# EAGLE design Adafruit WICED WiFi Feather (EAGLE 6.4)
COMPANY: ADAFRUIT INDUSTRIES; DRAWN: KTOWN; REV: A
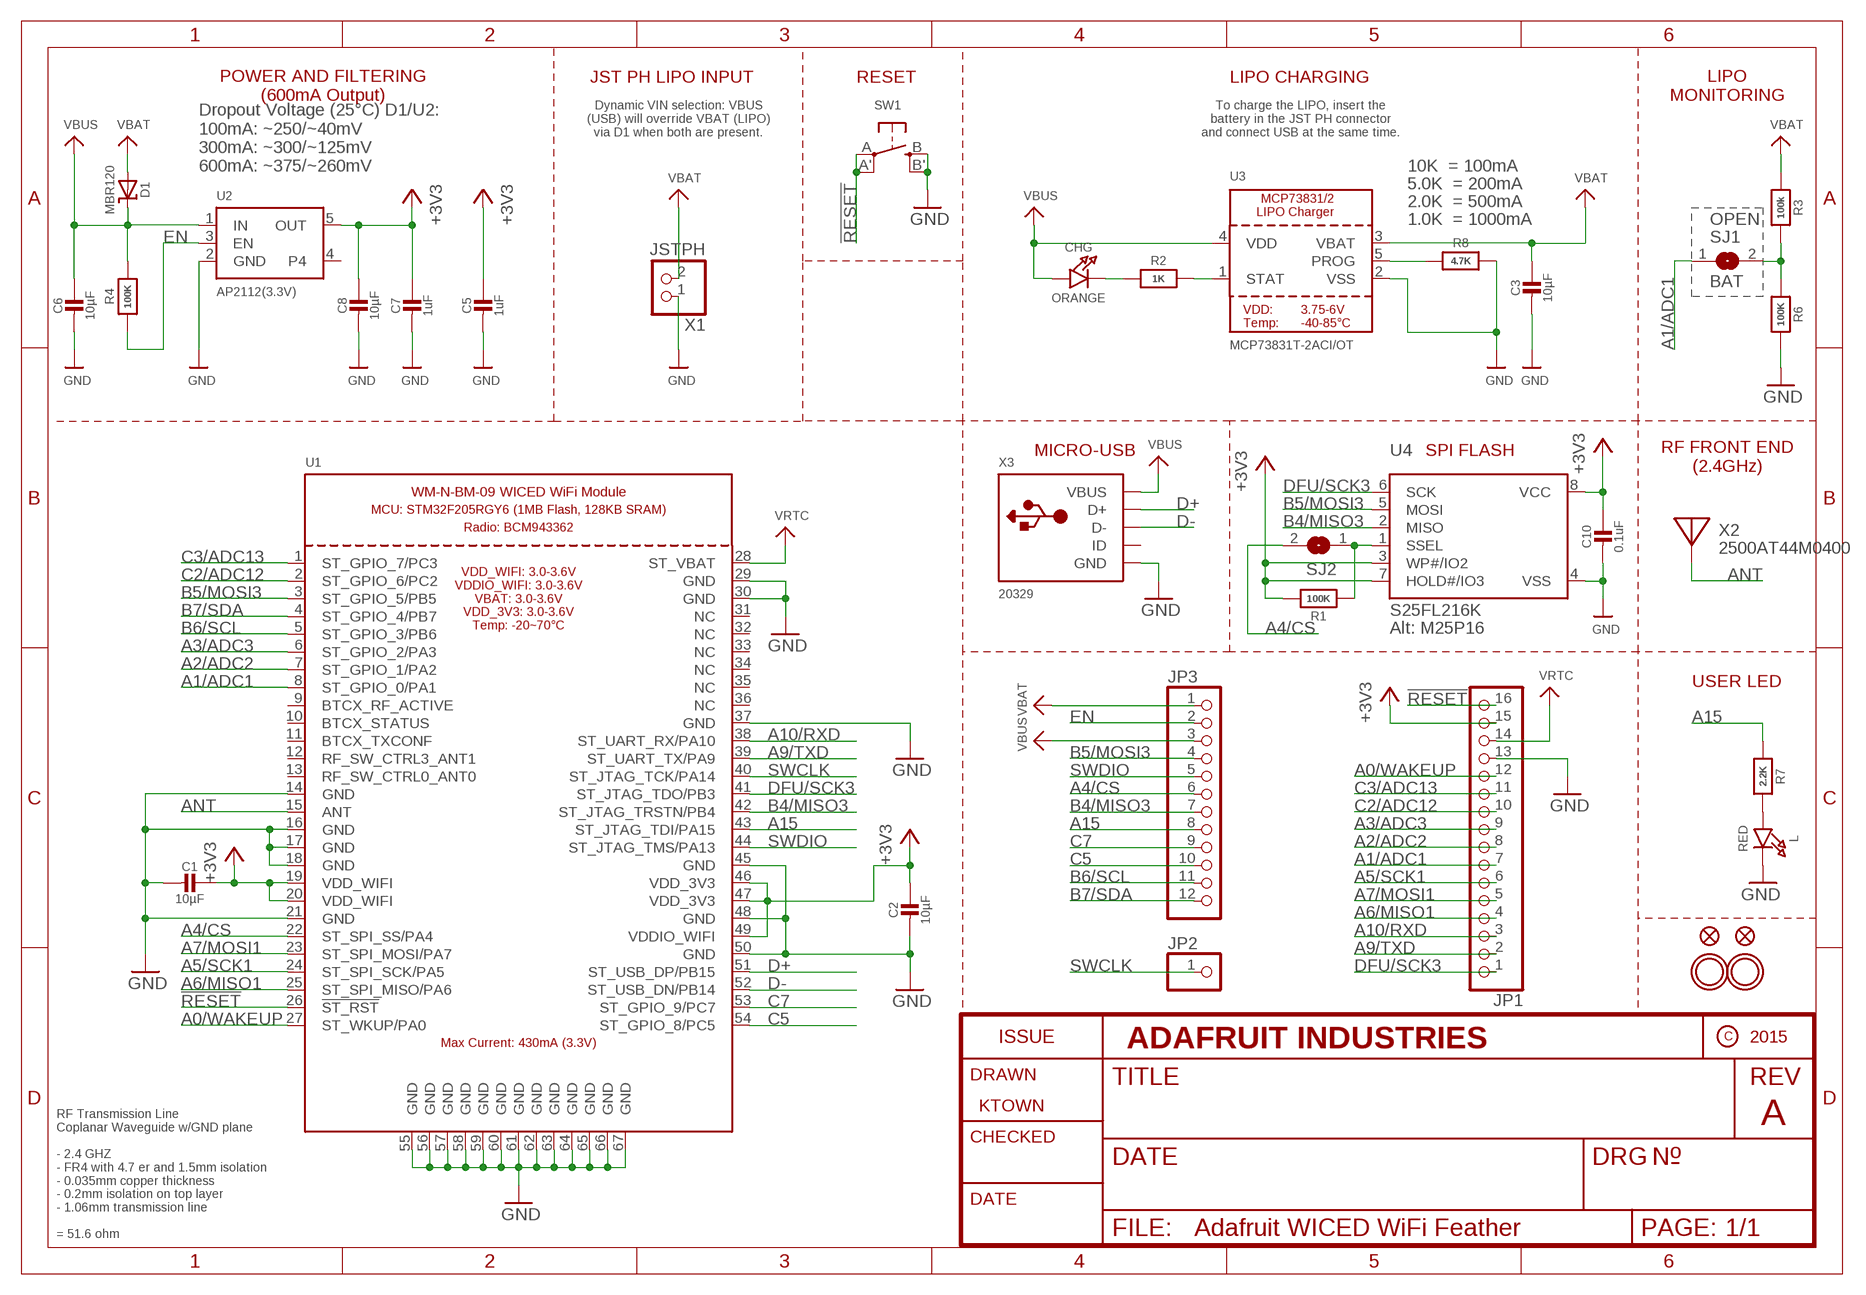
[diagram p0: schematic, sheet 1]

## Parts
C1  10µF  CAP_CERAMIC0805-NOOUTLINE  [0805-NO]
C2  10µF  CAP_CERAMIC0805-NOOUTLINE  [0805-NO]
C3  10µF  CAP_CERAMIC0805-NOOUTLINE  [0805-NO]
C5  1uF  CAP_CERAMIC0603_NO  [0603-NO]
C6  10µF  CAP_CERAMIC0805-NOOUTLINE  [0805-NO]
C7  1uF  CAP_CERAMIC0603_NO  [0603-NO]
C8  10µF  CAP_CERAMIC0805-NOOUTLINE  [0805-NO]
C10  0.1uF  CAP_CERAMIC0805_10MGAP  [0805_10MGAP]
CHG  ORANGE  LED0805_NOOUTLINE  [CHIPLED_0805_NOOUTLINE]
D1  MBR120  DIODE-SCHOTTKYSOD-123  [SOD-123]
JP1  HEADER-1X16ROUND  [1X16_ROUND]
JP2  HEADER-1X1ROUND  [1X01_ROUND]
JP3  HEADER-1X12  [1X12_ROUND]
L  RED  LED0805_NOOUTLINE  [CHIPLED_0805_NOOUTLINE]
R1  100K  RESISTOR_0603_NOOUT  [0603-NO]
R2  1K  RESISTOR_0603_NOOUT  [0603-NO]
R3  100k  RESISTOR_0603_NOOUT  [0603-NO]
R4  100K  RESISTOR_0603_NOOUT  [0603-NO]
R6  100K  RESISTOR_0603_NOOUT  [0603-NO]
R7  2.2K  RESISTOR_0603_NOOUT  [0603-NO]
R8  4.7K  RESISTOR_0603_NOOUT  [0603-NO]
SJ1  BAT  SOLDERJUMPERREFLOW_NOPASTE  [SOLDERJUMPER_REFLOW_NOPASTE]
SJ2  SOLDERJUMPER  [SOLDERJUMPER_ARROW_NOPASTE]
SW1  SWITCH_TACT_SMT4.6X2.8  [BTN_KMR2_4.6X2.8]
U1  USI_WM-N-BM-09  [USI_WM-N-BM-09]
U2  AP2112(3.3V)  VREG_SOT23-5  [SOT23-5]
U3  MCP73831T-2ACI/OT  MCP73831/2  [SOT23-5]
U4  S25FL216K  SPIFLASH_SOIC8  [SOIC8_150MIL]
U$31  MOUNTINGHOLE2.5  [MOUNTINGHOLE_2.5_PLATED]
U$32  MOUNTINGHOLE2.5  [MOUNTINGHOLE_2.5_PLATED]
U$34  FIDUCIAL""  [FIDUCIAL_1MM]
U$35  FIDUCIAL""  [FIDUCIAL_1MM]
X1  JSTPH  CON_JST_PH_2PIN  [JSTPH2]
X2  2500AT44M0400  ANTENNA_JOHANSON_2500AT44M0400  [ANT_2500AT44M0400]
X3  20329  USB_MICRO_20329_V2  [4UCONN_20329_V2]

## Nets
!RESET: JP1.16 SW1.A'(P1) SW1.A(P) U1.26(!ST_RST)
+3V3: C1.1 C2.1 C5.1 C7.1 C8.1 C10.1 JP1.15 R1.2 U1.19(VDD_WIFI) U1.20(VDD_WIFI) U1.46(VDD_3V3) U1.47(VDD_3V3) U1.49(VDDIO_WIFI) U2.5(OUT) U4.3(WP#/IO2) U4.7(HOLD#/IO3) U4.8(VCC)
A0/WAKEUP: JP1.12 U1.27(ST_WKUP/PA0)
A1/ADC1: JP1.7 SJ1.1 U1.8(ST_GPIO_0/PA1)
A2/ADC2: JP1.8 U1.7(ST_GPIO_1/PA2)
A3/ADC3: JP1.9 U1.6(ST_GPIO_2/PA3)
A4/CS: JP3.6 SJ2.2 U1.22(ST_SPI_SS/PA4)
A5/SCK1: JP1.6 U1.24(ST_SPI_SCK/PA5)
A6/MISO1: JP1.4 U1.25(ST_SPI_MISO/PA6)
A7/MOSI1: JP1.5 U1.23(ST_SPI_MOSI/PA7)
A9/TXD: JP1.2 U1.39(ST_UART_TX/PA9)
A10/RXD: JP1.3 U1.38(ST_UART_RX/PA10)
A15: JP3.8 R7.1 U1.43(ST_JTAG_TDI/PA15)
ANT: U1.15(ANT) X2.FEED
B4/MISO3: JP3.7 U1.42(ST_JTAG_TRSTN/PB4) U4.2(MISO)
B5/MOSI3: JP3.4 U1.3(ST_GPIO_5/PB5) U4.5(MOSI)
B6/SCL: JP3.11 U1.5(ST_GPIO_3/PB6)
B7/SDA: JP3.12 U1.4(ST_GPIO_4/PB7)
C2/ADC12: JP1.10 U1.2(ST_GPIO_6/PC2)
C3/ADC13: JP1.11 U1.1(ST_GPIO_7/PC3)
C5: JP3.10 U1.54(ST_GPIO_8/PC5)
C7: JP3.9 U1.53(ST_GPIO_9/PC7)
D+: U1.51(ST_USB_DP/PB15) X3.D+
D-: U1.52(ST_USB_DN/PB14) X3.D-
DFU/SCK3: JP1.1 U1.41(ST_JTAG_TDO/PB3) U4.6(SCK)
EN: JP3.2 R4.1 U2.3(EN)
GND: C1.2 C2.2 C3.2 C5.2 C6.2 C7.2 C8.2 C10.2 JP1.13 L.C R6.2 R8.2 SW1.B'(S1) SW1.B(S) U1.14(GND) U1.16(GND) U1.17(GND) U1.18(GND) U1.21(GND) U1.29(GND) U1.30(GND) U1.37(GND) U1.45(GND) U1.48(GND) U1.50(GND) U1.55(GND) U1.56(GND) U1.57(GND) U1.58(GND) U1.59(GND) U1.60(GND) U1.61(GND) U1.62(GND) U1.63(GND) U1.64(GND) U1.65(GND) U1.66(GND) U1.67(GND) U2.2(GND) U3.2(VSS) U4.4(VSS) X1.1 X3.BASE@1(GND) X3.BASE@2(GND) X3.GND X3.SPRT@1(GND) X3.SPRT@2(GND) X3.SPRT@3(GND) X3.SPRT@4(GND)
N$1: CHG.C R2.1
N$2: L.A R7.2
N$3: R2.2 U3.1(STAT)
N$4: R8.1 U3.5(PROG)
N$5: R3.2 R6.1 SJ1.2
N$6: R1.1 SJ2.1 U4.1(SSEL)
SWCLK: JP2.1 U1.40(ST_JTAG_TCK/PA14)
SWDIO: JP3.5 U1.44(ST_JTAG_TMS/PA13)
VBAT: C3.1 D1.A JP3.1 R3.1 U3.3(VBAT) X1.2
VBUS: C6.1 CHG.A D1.C JP3.3 R4.2 U2.1(IN) U3.4(VDD) X3.VBUS
VRTC: JP1.14 U1.28(ST_VBAT)
Unconnected: U1.9(BTCX_RF_ACTIVE) U1.10(BTCX_STATUS) U1.11(BTCX_TXCONF) U1.12(RF_SW_CTRL3_ANT1) U1.13(RF_SW_CTRL0_ANT0) U1.31(NC) U1.32(NC) U1.33(NC) U1.34(NC) U1.35(NC) U1.36(NC) U2.4 X3.ID

## Notes on the sheet
- JST PH LIPO INPUT | RESET | LIPO CHARGING
- POWER AND FILTERING
  (600mA Output)
- LIPO
  MONITORING
- Dynamic VIN selection: VBUS
  (USB) will override VBAT (LIPO)
  via D1 when both are present.
- To charge the LIPO, insert the
  battery in the JST PH connector
  and connect USB at the same time.
- Dropout Voltage (25°C) D1/U2:
  100mA: ~250/~40mV
  300mA: ~300/~125mV
  600mA: ~375/~260mV
- 10K  = 100mA
- 5.0K  = 200mA
- 2.0K  = 500mA
- 1.0K  = 1000mA | OPEN
- MICRO-USB | SPI FLASH
- RF FRONT END
  (2.4GHz)
- Alt: M25P16
- USER LED
- RF Transmission Line
  Coplanar Waveguide w/GND plane
  
  - 2.4 GHZ
  - FR4 with 4.7 er and 1.5mm isolation
  - 0.035mm copper thickness
  - 0.2mm isolation on top layer
  - 1.06mm transmission line
  
  = 51.6 ohm

## Library data of the parts
C1-C3 C5-C8 C10 = microbuilder:CAP_CERAMIC: Ceramic Capacitors For new designs, use the packages preceded by an '_' character since they are more reliable: The following footprints should be used on most boards: _0402 - Standard footprint for regular board layouts _0603 - Standard footprint for regular board layouts _0805 - Standard footprint for regular board layouts _1206 - Standard footprint for regular board layouts For extremely tight-pitch boards where space is at a premium, the following 'micro-pitch' footprints can be used (smaller pads, no silkscreen outline, etc.): _0402MP - Micro-pitch footprint for very dense/compact boards _0603MP - Micro-pitch footprint for very dense/compact boards _0805MP - Micro-pitch footprint for very dense/compact boards _1206MP - Micro-pitch footprint for very dense/compact boards
CHG L = microbuilder:LED: LED 0603 - 0603 Surface Mount Package 2mA: Green LED - Low Power (3.9mcd, 2ma, 1.7Vf) - Digikey: 475-2709-2-ND Orange LED - Low Power (9.8mcd, 2ma, 1.8Vf) - Digikey: 475-1194-2-ND Red LED - Low Power (5mcd, 2ma, 1.8Vf) - Digikey: 475-1195-2-ND Yellow LED - Low Power (7mcd, 2ma, 1.8Vf) - Digikey: 475-1196-2-ND 5mA: Blue LED - Low Power (17mcd, 5ma, 2.9Vf) - Digikey: LNJ937W8CRACT-ND 0805 - 0805 Surface Mount Package 2mA: Red LED (8.8mcd, 2mA, 1.8Vf, Clear) - Low Power [Digikey: 475-2510-1-ND] Green LED (5mcd, 2mA, 1.8Vf, Clear) - Low Power [Digikey: 475-2730-1-ND] Yellow LED (11.3mcd, 2mA, 1.8Vf, Clear) - Low Power [Digikey: 475-2555-1-ND] 20mA: Red LED (104mcd, 20mA, Diffused) - LS R976 [Digikey: 475-1278-6-ND] Red LED (12mcd, 20mA, 2.0Vf, Clear) - APT2012EC [Digikey: 754-1128-1-ND] Green LED (15mcd, 20mA, 2.2Vf, Clear) - APT2012GC [Digikey: 754-1131-1-ND] Orange LED (160mcd, 20mA, 2.1Vf, Clear) - APT2012SECK [Digikey: 754-1130-1-ND] 1206 - 1206 Surface Mount Package Green LED (26mcd, 20mA, Diffused) - LG N971 [Digikey: 475-1407-6-ND] Red LED (15mcd, 20mA, Diffused) - LH N974 [Digikey: 475-1416-6-ND] Cree - Cree High-Power Surface Mount LEDs XPEBWT-L1-0000-00D50 - White 111lm 350mA 2.9Vf 6200K 110° XTEAWT-00-0000-00000LEE3 - White 114lm 350mA 2.85Vf 5000K 115° Everlight - Everlight 45-21 Series Surface Mount LEDs 45-21/QK2C-B2832AC2CB2/2T - Warm White 2000mcd 20mA 3.25Vf 3050K 120° 45-21/LK2C-B38452C4CB2/2T - Nuetral White 2000mcd 20mA 3.25Vf 4150K 120° 45-21/LK2C-B50634C6CB2/2T - Cold White 2200mcd 20mA 3.25Vf 5650K 120° PLCC2 Reverse Mount LS T77K-J1L2-1-0-2-R18-Z - Red 11.25mcd 2mA 1.8Vf 630nm 120° LO T77K-L1M2-24-Z - Orange 19.6mcd 2mA 1.8Vf 606nm 120° LY T77K-K2M1-26-Z - Yellow 15.7mcd 2mA 1.8Vf 587nm 120°
D1 = microbuilder:DIODE-SCHOTTKY
JP1 = microbuilder:HEADER-1X16: PIN HEADER
JP2 = microbuilder:HEADER-1X1: PIN HEADER
JP3 = microbuilder:HEADER-1X12
R1-R4 R6-R8 = microbuilder:RESISTOR: Resistors For new designs, use the packages preceded by an '_' character since they are more reliable: The following footprints should be used on most boards: _0402 - Standard footprint for regular board layouts _0603 - Standard footprint for regular board layouts _0805 - Standard footprint for regular board layouts _1206 - Standard footprint for regular board layouts For extremely tight-pitch boards where space is at a premium, the following 'micro-pitch' footprints can be used (smaller pads, no silkscreen outline, etc.): _0402MP - Micro-pitch footprint for very dense/compact boards _0603MP - Micro-pitch footprint for very dense/compact boards _0805MP - Micro-pitch footprint for very dense/compact boards _1206MP - Micro-pitch footprint for very dense/compact boards
SJ1 = microbuilder:SOLDERJUMPER: SMD Solder JUMPER Solder the two pads together to create a connection, or remove the solder to break it. REFLOW - Use this footprint for solder paste and reflow ovens. WAVE - Use this footprint for hand-soldering (larger pads). CLOSED - Has a trace between the two pads to ensure it is closed by default. The trace needs to be cut to disable the jumper, and can be closed again by creating a solder bridge between the two pads.
SJ2 = microbuilder:SOLDERJUMPER: SMD Solder JUMPER Solder the two pads together to create a connection, or remove the solder to break it. REFLOW - Use this footprint for solder paste and reflow ovens. WAVE - Use this footprint for hand-soldering (larger pads). CLOSED - Has a trace between the two pads to ensure it is closed by default. The trace needs to be cut to disable the jumper, and can be closed again by creating a solder bridge between the two pads.; BOM: EXCLUDE
SW1 = microbuilder:SWITCH_TACT_SMT: SMT Tact Switches 6x6mm - Digikey: P12940SCT-ND KMR2 (4.6x2.8mm) - Digikey: 401-1426-1-ND EVQ-PQHB55 - Light Touch, 160GF (4.5x4.5mm) - Digikey: P8090SCT-ND KMT0 - KMT021 NGJ LHS (etc.) IP68/Waterproof - Digikey: CKN10289CT-ND
U1 = microbuilder:USI_WM-N-BM-09: USI WM-N-BM-09 WICED WiFi Module
U2 = microbuilder:VREG_SOT23-5: SOT23-5 Fixed Voltage Regulators Part Current Out V Out V In V Dropout θJA (°C/W) TJ (°C) Digikey Part No. ADP121 150mA 3.3V 3.4-5.5V 0.09V @ 150mA -- -- ADP121-AUJZ33R7CT-ND ADP121 150mA 3.0V 3.1-5.5V 0.09V @ 150mA -- -- ADP121-AUJZ30R7CT-ND ADP122 300mA 3.3V 3.4-5.5V 0.085V @ 300mA -- -- ADP122AUJZ-3.3-R7CT-ND ADP1712 300mA 3.3V 3.5-5.5V 0.17V @ 300mA -- -- ADP1712AUJZ-3.3-R7TR-ND AP7311 (Low Cost) 150mA 3.3V 3.5-6V 0.15V @ 150mA -- -- AP7311-33WG-7DICT-ND LD39015M18R 150mA 1.8V 1.9V-5.5V 0.08V @ 100mA -- -- 497-6977-1-ND LP2985A-33DBVR 150mA 3.3V 3.3-16V 0.28V @ 150mA 206 150 296-18479-1-ND MCP1824T-3302E/OT 300mA 3.3V 3.5V-6V 0.2V @ 300mA -- -- MCP1824T-3302E/OTCT-ND MIC5205-2.5YM5 TR 150mA 2.5V 2.7-16V 0.165V @ 150mA -- -- 576-1257-2-ND MIC5205-3.0YM5 TR 150mA 3.0V 3.2V-16V 0.165V @ 150mA -- -- 576-1258-2-ND MIC5205-3.3YM5 TR 150mA 3.3V 3.5V-16V 0.165V @ 150mA -- -- 576-1259-2-ND TPS780330220 150mA 3.3V+2.2V 3.6-5.5V 250mV Max -- -- 296-23332-1-ND TDA3663/N1,135 100mA 3.3V 3.5-45V 0.18V @ 50mA -- -- 568-5343-1-ND Max operating temp can be calculated using θJA, TJ (max junction temperature), and power in watts. Set the "Maximum Ambient Temperature" until it reaches TJ ("Max Junction Temperature"), which is the absolute limit for safe use of the regulator: Heat Sink Temperature Calculator <http://www.daycounter.com/Calculators/Heat-Sink-Temperature-Calculator.phtml> For example, With 12V source into a 3.3V LP2985 and a 30mA load, we are dissipating (12V-3.3V) * 0.03A = 0.261W. With a θJA of 206 °C/W, a TJ of 150°C, and 261mW we can safely use the chip without a heat sink up to 75°C (=147.1°C Junction Temperature).
U3 = microbuilder:MCP73831/2: MCP73831/2 LIPO Charger VDD: 3.75 - 6V Temp -40 - 85°C Programmable Charge Rate: 15-500mA NOTE: STAT is a tri-state logic output on the MCP73831 and an open-drain output on the MCP73832. SOT23-5 with 4.2V output and tri-state logic on STAT = MCP73831T-2ACI/OT
U4 = microbuilder:SPIFLASH_SOIC8: SOIC8 SPI Flash Be careful with the size since SOIC8 flash comes in several 'widths' SOIC8 150 mil M25P16 - 16Mbit (2Mbit x 8) Serial Flash (75MHz SPI Bus), Supply: 2.7-3.6V Digikey: SOIC8 - M25P16-VMN6P-ND SOIC8 208 mil W25Q16BVSSIG - 16Mbit (2Mbit x 8) Serial Flash (104MHz SPI Bus), Supply: 2.7-3.6V Digikey: SOIC8 - W25Q16BVSSIG-ND
U$31 U$32 = microbuilder:MOUNTINGHOLE: Mounting Hole For #2 screws (0.086"/2.18mm width, 0.094"/2.4mm hole) use 2.5mm; BOM: EXCLUDE
U$34 U$35 = microbuilder:FIDUCIAL: Fiducial Alignment Points Various fiducial points for machine vision alignment.; BOM: EXCLUDE
X1 = microbuilder:CON_JST_PH_2PIN: JST 2-Pin Right-Angle Connector PH-Series - 4UConnector: 17311 SH-Series - 4UConnector: 07278
X2 = microbuilder:ANTENNA_JOHANSON_2500AT44M0400: Johanson 2.3-2.7 GHz Chip Antenna Frequency Range: 2400 - 2500 Mhz Peak Gain 2.5 dBi typ. (XZ-V) Average Gain 0.5 dBi typ. (XZ-V) Input Power 3W max. Operating Temperature -40 to +85°C Digikey: 712-1403-1-ND Mouser: 609-2500AT44M0400E
X3 = microbuilder:USB: USB Connectors USBMINIB - Surface Mount Female Mini-B USB Connector 4UConnector: 06564

## Board
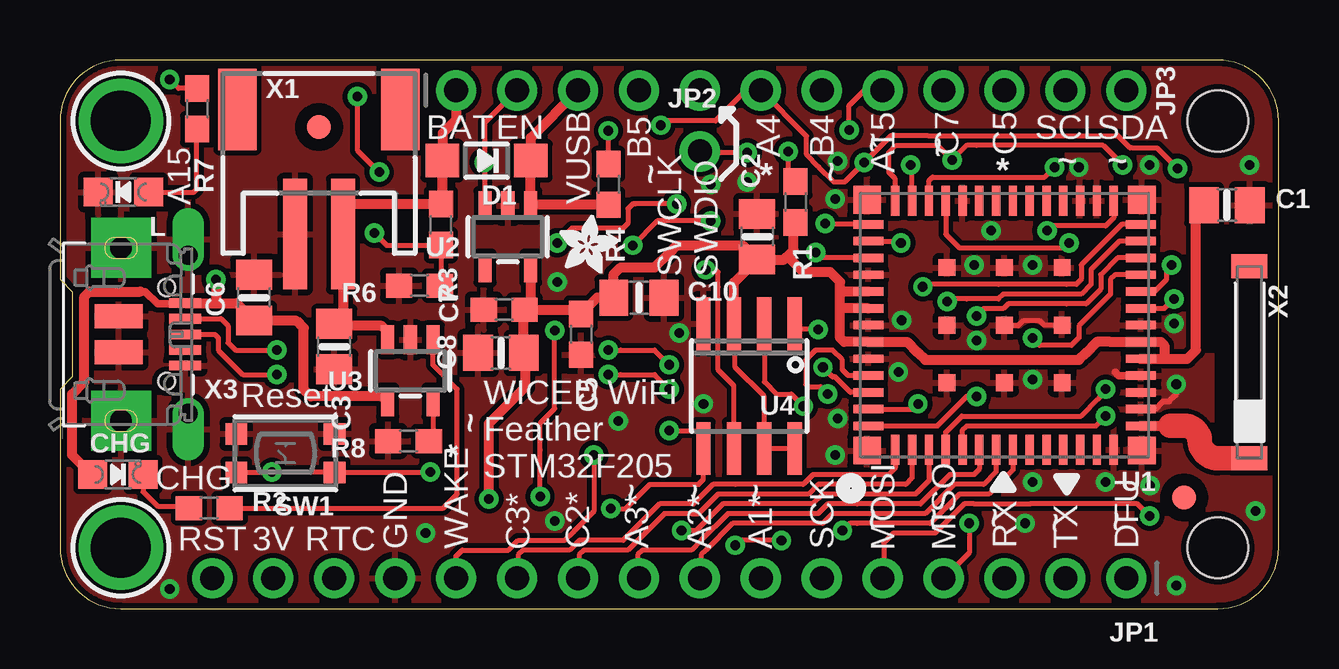
[diagram p1: board, top side]
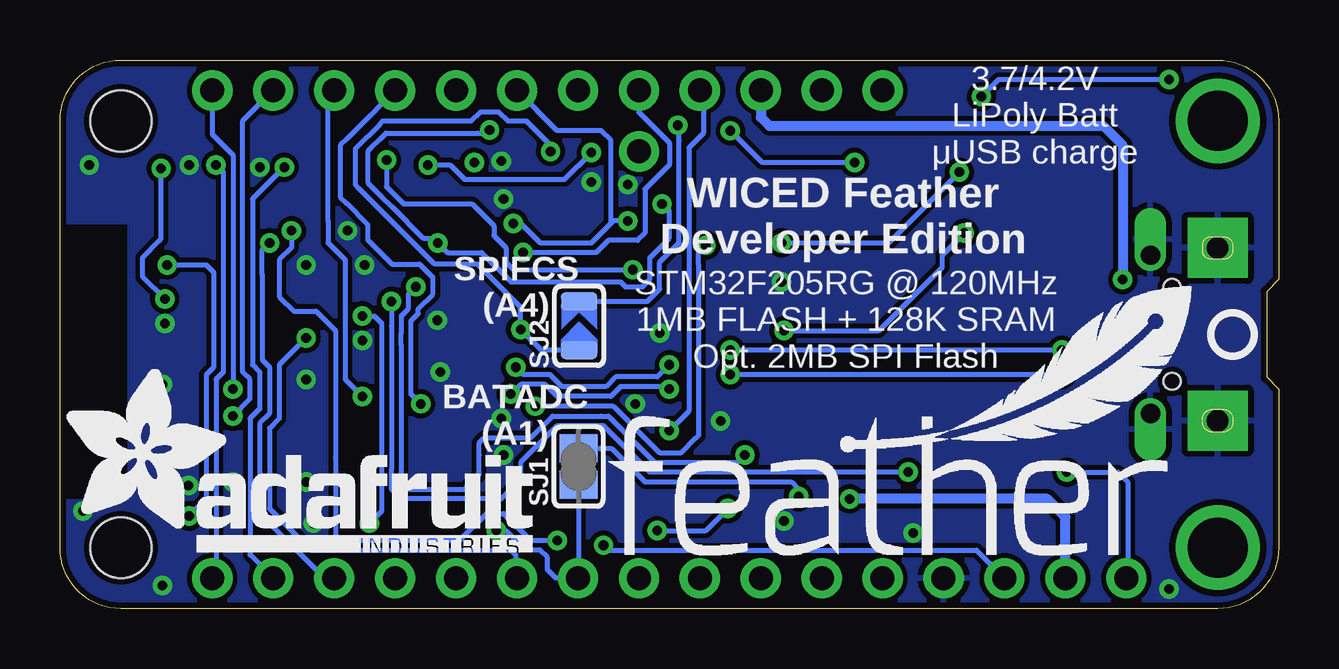
[diagram p2: board, bottom side, seen from below]

Size 50.8 x 22.86 mm. Coordinates in mm from the lower left corner, seen from the top.
Outline: 2.54,0 48.26,0 arc90 50.8,2.54 50.8,20.32 arc90 48.26,22.86 2.54,22.86 arc90 0,20.32 0,13.72 0.51,13.21 0.51,9.65 0,9.14 0,2.54 arc90 2.54,0
Copper layers (1*16): Top 0.035mm / dielectric 1.5mm / Bottom 0.035mm
Design rules "adafruit *": minimum track width 8mil, minimum drill 15.5mil, track to track 8mil, track to pad 8mil, pad to pad 8mil, via to via 8mil, smd to smd 8mil, copper to edge 10mil, drill to drill 8mil, minimum pad ring 10mil, minimum via ring 8mil, stop-mask expansion 2mil, vias tented up to drill 20mil, thermal gap 10mil
Holes 2.54 mm at 48.26,20.32 48.26,2.54
tRestrict: area 44.2,6.4 to 44.3,6.8; area 44.8,8.6 to 45.3,8.7; area 44.8,9.3 to 45.3,9.4; area 42.8,16.8 to 42.9,17.3; area 48.1,7 to 50.5,13.6; area 48.1,13.6 to 48.6,16; area 48.6,14.9 to 50.5,16; area 47.8,10.7 to 48.1,16
bRestrict: area 48,4.6 to 50.5,16

### Footprints (pad centres in the part's own frame; a part is rotated, then mirrored left to right if it is on the bottom)
0805-NO = smd 1.24 x 1.5: 1 -0.95,0; 2 0.95,0
0603-NO = smd 1.1 x 1: 1 -0.85,0; 2 0.85,0
0805_10MGAP = smd 1.2 x 1.5: 1 -1.05,0; 2 1.05,0
CHIPLED_0805_NOOUTLINE = smd 1.2 x 1.2: A 0,-1.05; C 0,1.05
SOD-123 = smd 1.4 x 1.4: A 1.85,0; C -1.85,0
1X16_ROUND = drill 1 pad 1.676: 1 -19.05,0; 2 -16.51,0; 3 -13.97,0; 4 -11.43,0; 5 -8.89,0; 6 -6.35,0; 7 -3.81,0; 8 -1.27,0; 9 1.27,0; 10 3.81,0; 11 6.35,0; 12 8.89,0; 13 11.43,0; 14 13.97,0; 15 16.51,0; 16 19.05,0
1X01_ROUND = drill 1 pad 1.676: 1 0,0
1X12_ROUND = drill 1 pad 1.676: 1 -13.97,0; 2 -11.43,0; 3 -8.89,0; 4 -6.35,0; 5 -3.81,0; 6 -1.27,0; 7 1.27,0; 8 3.81,0; 9 6.35,0; 10 8.89,0; 11 11.43,0; 12 13.97,0
SOLDERJUMPER_REFLOW_NOPASTE = smd 1.168 x 1.6: 1 -0.762,0; 2 0.762,0
SOLDERJUMPER_ARROW_NOPASTE = smd 0.762 x 1.524: 1 -1.016,0; 2 1.016,0
BTN_KMR2_4.6X2.8 = smd 0.9 x 0.9: A 2.05,0.8; A' -2.05,0.8; B 2.05,-0.8; B' -2.05,-0.8
USI_WM-N-BM-09 = smd 0.35 x 1.25: 1 4.55,5.188; 2 3.85,5.188; 3 3.15,5.188; 4 2.45,5.188; 5 1.75,5.188; 6 1.05,5.188; 7 0.35,5.188; 8 -0.35,5.188; 9 -1.05,5.188; 10 -1.75,5.188; 11 -2.45,5.188; 12 -3.15,5.188; 13 -3.85,5.188; 14 -4.55,5.188; 28 -4.55,-5.188; 29 -3.85,-5.188; 30 -3.15,-5.188; 31 -2.45,-5.188; 32 -1.75,-5.188; 33 -1.05,-5.188; 34 -0.35,-5.188; 35 0.35,-5.188; 36 1.05,-5.188; 37 1.75,-5.188; 38 2.45,-5.188; 39 3.15,-5.188; 40 3.85,-5.188; 41 4.55,-5.188 | smd 1.25 x 0.35: 15 -5.675,4.2; 16 -5.675,3.5; 17 -5.675,2.8; 18 -5.675,2.1; 19 -5.675,1.4; 20 -5.675,0.7; 21 -5.675,0; 22 -5.675,-0.7; 23 -5.675,-1.4; 24 -5.675,-2.1; 25 -5.675,-2.8; 26 -5.675,-3.5; 27 -5.675,-4.2; 42 5.675,-4.2; 43 5.675,-3.5; 44 5.675,-2.8; 45 5.675,-2.1; 46 5.675,-1.4; 47 5.675,-0.7; 48 5.675,0; 49 5.675,0.7; 50 5.675,1.4; 51 5.675,2.1; 52 5.675,2.8; 53 5.675,3.5; 54 5.675,4.2 | smd 1.15 x 1.15: 55 5.725,5.225; 56 -5.725,5.225; 57 -5.725,-5.225; 58 5.725,-5.225 | smd 0.7 x 0.7: 59 2.4,2.4; 60 0,2.4; 61 -2.4,2.4; 62 2.4,0; 63 0,0; 64 -2.4,0; 65 2.4,-2.4; 66 0,-2.4; 67 -2.4,-2.4
SOT23-5 = smd 0.55 x 1.2: 1 -0.95,-1.3; 2 0,-1.3; 3 0.95,-1.3; 4 0.95,1.3; 5 -0.95,1.3
SOIC8_150MIL = smd 0.6 x 2.2: 1 -1.905,-2.6; 2 -0.635,-2.6; 3 0.635,-2.6; 4 1.905,-2.6; 5 1.905,2.6; 6 0.635,2.6; 7 -0.635,2.6; 8 -1.905,2.6
MOUNTINGHOLE_2.5_PLATED = drill 2.5 pad 3.2: P$1 0,0
FIDUCIAL_1MM = smd 1 x 1: 1 0,0
JSTPH2 = smd 1 x 4.6: 1 -1,-3.7; 2 1,-3.7 | smd 1.6 x 3.4: NC1 -3.4,1.5; NC2 3.4,1.5
ANT_2500AT44M0400 = smd 1 x 1.5: FEED 4,0; NC -4,0
4UCONN_20329_V2 = smd 1 x 2: BASE@1 -0.75,-2; BASE@2 0.75,-2 | smd 0.4 x 1.35: D+ 0,0.775; D- -0.65,0.775; GND 1.3,0.775; ID 0.65,0.775; VBUS -1.3,0.775 | drill 0.8 pad 1.2 offset: SPRT@1 -3.3,0.9; SPRT@2 3.3,0.9 | drill 0.9 pad 2.5 square: SPRT@3 -3.6,-1.9; SPRT@4 3.6,-1.9 | hole 0.7: -1.95,0; 1.95,0

### Placement (x,y rotation side)
C1  48.64,16.81 0 top
C2  29.06,15.49 90 top
C3  11.43,10.92 270 top
C5  21.72,11.43 270 top
C6  8.09,12.96 90 top
C7  18.52,12.46 180 top
C8  18.38,10.65 180 top
C10  24.13,12.95 0 top
CHG  2.41,5.59 270 top
D1  17.78,18.67 180 top
JP1  25.4,1.27 180 top
JP2  26.67,19.05 0 top
JP3  30.48,21.59 0 top
L  2.65,17.36 90 top
R1  30.66,16.94 270 top
R2  6.22,4.19 0 top
R3  15.88,16 270 top
R4  22.86,17.68 270 top
R6  14.99,13.46 180 top
R7  5.71,20.83 270 top
R8  14.53,6.99 180 top
SJ1  29.18,5.92 90 bottom
SJ2  29.16,11.79 90 bottom
SW1  9.4,6.48 180 top
U1  39.37,11.81 180 top
U2  18.67,15.49 180 top
U3  14.61,9.91 180 top
U4  28.73,9.27 180 top
U$7  [FEATHERLOGO]  27.94,2.16 0 bottom
U$8  [ADAFRUIT_2.5MM]  20.83,13.97 0 top
U$10  [ADAFRUIT_TEXT_20MM]  50.67,2.36 0 bottom
U$23  [PCBFEAT-REV-040]  1.93,11.43 90 bottom
U$31  2.54,20.32 270 top
U$32  2.54,2.54 270 top
U$34  10.79,20.07 270 top
U$35  46.86,4.63 270 top
X1  10.79,19.3 0 top
X2  49.58,10.26 270 top
X3  4.45,11.43 270 top

### Tracks (layer width: path | path; a pad name or v marks a point on that pad's centre or on a via)
!RESET  (via drill 0.4)
  Top 0.203: SW1.A 8.83,5.68 v8.84,5.69 8.85,5.68 SW1.A' 15.43,5.68 v15.44,5.69 | U1.26 44.16,15.31 42.98,14.12 42.98,13.51 42.57,13.11 41.96,13.11 39.32,13.11 39.12,12.9 37.8,12.9 37.08,12.9 v36.98,12.8
  Bottom 0.203: v8.84,5.69 6.71,5.69 6.3,5.28 6.3,1.32 JP1.16 | v36.98,12.8 36.98,11.79 36.98,5.79 36.98,4.98 36.58,4.57 32.41,4.57 31.6,5.28 31.6,6.1 30.07,7.62 28.14,7.62 26.21,5.69 23.27,5.69 v15.44,5.69
+3V3  (via drill 0.4)
  Top 0.203: U4.3 28.14,11.82 28.14,10.06 29.36,8.84 U4.7 U4.8 | 30.58,16.02 R1.2
  Top 0.305: 32.72,13.21
  Top 0.406: v17.88,4.57 17.88,7.72 19.41,9.25 19.41,10.63 C8.1 19.33,12.43 C7.1 | 19.43,12.43 C7.1 | U2.5 19.62,12.61 C7.1 | C7.1 21.53,12.46 C5.1 22.39,12.95 C10.1 23.08,13.94 23.37,14.22 24.79,14.22 25.4,14.83 25.7,15.14 28.46,15.14 C2.1 | 28.94,14.43 C2.1 | U4.3 28.09,13.58 C2.1 | C2.1 30.19,14.54 30.33,14.68 | 30.33,14.68 30.58,14.94 30.58,16.02 | 32.51,13.21 32.72,13.21 U1.46 | U1.19 46.02,10.41 | 46.02,10.41 46.99,10.41 47.35,10.77 47.35,16.47 C1.1 | 46.02,10.41 46.02,10.97 45.89,11.11 U1.20 43.79,11.11 43.22,11.11 43.18,11.07 42.77,10.67 42.47,10.36 36.07,10.36 35.76,10.67 35.32,11.11 U1.49 32.68,11.11 32.51,11.28 32.51,12.5 | 32.51,12.5 32.51,13.21 | U1.47 32.53,12.51 32.51,12.5 | 32.51,13.21 32.51,13.61 32.11,14.02 30.99,14.02 30.33,14.68 | 28.77,14.83 C2.1
  Bottom 0.406: JP1.15 8.89,3.81 9.65,4.57 v17.88,4.57
A0/WAKEUP  (via drill 0.4)
  Top 0.203: U1.27 44.26,16.01 43.79,15.54 42.57,14.33 42.57,13.72 42.37,13.51 41.96,13.51 39.12,13.51 36.25,13.51 36.07,13.51 v35.97,13.41 | JP1.12 16.51,2.18 16.76,2.44 18.69,2.44 19.1,2.85 21.03,2.85 21.44,3.25 22.25,4.06 v22.25,6.4
  Bottom 0.203: v22.25,6.4 22.55,6.1 23.06,6.1 26.01,6.1 27.94,8.03 28.25,8.03 30.28,8.03 31.19,7.11 33.12,7.11 33.33,6.91 33.33,6.4 33.33,5.59 33.93,4.98 36.37,4.98 36.58,5.18 36.58,5.79 36.58,10.97 36.58,11.48 36.58,12.19 36.27,12.5 36.27,13.11 v35.97,13.41
A1/ADC1  (via drill 0.4)
  Top 0.203: U1.8 39.72,5.79 38.71,4.78 37.49,4.78 36.27,3.56 33.22,3.56 32.92,3.56 v32.61,3.25
  Bottom 0.203: v32.61,3.25 32.21,3.25 31.39,2.44 30.79,2.44 30.48,2.13 30.48,1.63 30.12,1.27 JP1.7 29.18,1.29 SJ1.1
A2/ADC2
  Top 0.203: U1.7 39.02,5.7 38.51,5.18 37.29,5.18 36.07,3.96 33.22,3.96 32.31,3.96 32.21,3.96 31.8,3.56 28.04,3.56 26.92,2.44 26.72,2.23 26.72,1.32 JP1.8
A3/ADC3
  Top 0.203: U1.6 38.32,5.81 38.1,5.59 37.08,5.59 35.87,4.37 33.22,4.37 32.11,4.37 32,4.37 31.6,3.96 27.84,3.96 26.72,2.85 26.31,2.44 24.28,2.44 24.08,2.23 24.08,1.32 JP1.9
A4/CS  (via drill 0.4)
  Top 0.203: U1.22 46.04,12.51 v46.43,12.9 | v46.58,18.34 45.72,19.2 44.7,19.2 44.6,19.2 44.2,19.61 44.09,19.71 36.17,19.71 34.65,19.71 34.14,19.2 v33.53,18.59 32.72,17.78 32.26,17.78 31.62,18.41 31.11,18.92 31.11,19.68 JP3.6 28.6,21.59 27.33,20.32 25.22,20.32 v25.04,20.14
  Bottom 0.203: v46.43,12.9 47.35,13.82 47.35,14.63 46.63,15.34 46.58,15.39 v46.58,18.34 | SJ2.2 26.31,12.8 25.81,13.31 25.81,14.43 24.99,15.24 24.99,19.51 24.99,19.94 24.99,20.09 v25.04,20.14
A5/SCK1  (via drill 0.4)
  Top 0.203: U1.24 43.98,13.91 43.79,13.72 43.79,13.11 42.47,11.79 42.47,11.28 42.16,10.97 40.84,10.97 v40.54,11.28
  Bottom 0.203: JP1.6 31.8,1.32 31.8,2.23 32,2.44 40.34,2.44 41.66,3.76 42.06,4.17 42.06,7.52 41.66,7.92 41.66,10.16 v40.54,11.28
A6/MISO1  (via drill 0.4)
  Top 0.203: U1.25 44.08,14.61 43.38,13.92 43.38,13.31 42.77,12.7 41.96,12.7 39.52,12.7 39.32,12.5 38.51,12.5 v38.2,12.19 | v37.9,3.56 37.9,2.34 JP1.4
  Bottom 0.203: v38.2,12.19 37.69,12.19 37.39,11.89 37.39,4.06 v37.9,3.56
A7/MOSI1  (via drill 0.4)
  Top 0.203: U1.23 45.62,13.21 45.92,13.51 46.13,13.72 46.13,14.12 v46.33,14.33 | v45.41,3.86 44.91,4.37 40.44,4.37 38.1,4.37 37.69,4.37 36.47,3.15 34.75,3.15 34.34,2.74 34.34,1.32 JP1.5
  Bottom 0.203: v46.33,14.33 44.7,14.33 44.4,14.02 44.4,10.06 44.7,9.75 44.7,5.59 44.7,4.57 v45.41,3.86
A9/TXD  (via drill 0.4)
  Top 0.203: U1.39 36.22,17.83 36.37,17.98 41.05,17.98 v41.45,18.39
  Bottom 0.203: v41.45,18.39 41.91,17.93 42.77,17.07 42.77,10.16 42.47,9.86 42.47,8.33 42.88,7.92 42.88,2.23 JP1.2
A10/RXD  (via drill 0.4)
  Top 0.203: U1.38 36.92,15.61 36.98,15.54 37.19,15.34 37.49,15.04 41.86,15.04 v42.06,15.24
  Bottom 0.203: JP1.3 39.78,1.27 41.45,2.95 42.47,3.96 42.47,7.72 42.06,8.13 42.06,10.06 42.37,10.36 42.37,13.92 42.37,14.94 v42.06,15.24
A15  (via drill 0.4)
  Top 0.203: R7.1 4.94,21.68 v4.57,22.05 | v12.39,21.34 12.39,19.1 v13.31,18.19 | U1.43 34.98,15.31 v35.05,15.24 | v25.7,16.87 23.98,16.87 23.88,16.87 23.67,16.66 23.67,16.05 23.47,15.85 22.66,15.85 21.34,15.85 v20.73,15.24 | v32.89,19.94 32.89,20.95 33.53,21.59 JP3.8
  Bottom 0.203: v4.57,22.05 11.68,22.05 v12.39,21.34 | v25.7,16.87 25.4,16.56 25.4,15.44 26.21,14.63 26.21,13.72 26.52,13.41 27.23,13.41 27.43,13.61 32,13.61 33.22,14.83 34.65,14.83 v35.05,15.24 35.26,15.44 35.66,15.44 36.98,16.76 37.39,17.17 37.97,17.75 37.97,19.05 37.85,19.18 37.47,19.56 37.21,19.81 33.4,19.81 33.02,19.81 v32.89,19.94 | v20.73,15.24 16.26,15.24 v13.31,18.19
ANT
  Top 0.406: U1.15 46.29,7.61
  Top 1.016: X2.FEED 48.24,6.26 arc-90 47.5,7.1 arc90 46.69,7.61 46.29,7.61
B4/MISO3  (via drill 0.4)
  Top 0.203: U1.42 31.94,16.01 v31.9,16.05 | v27.13,16.15 24.89,16.15 v23.88,15.14 | U4.2 29.36,9.45 29.87,8.94 30.48,8.94 v30.99,8.43
  Bottom 0.203: v31.9,16.05 31.6,16.05 30.79,15.24 28.65,15.24 27.84,16.05 | 27.84,16.05 27.84,19.51 28.25,19.91 30.07,19.91 JP3.7 | v27.13,16.15 27.74,16.15 27.84,16.05 | v23.88,15.14 24.18,14.83 24.18,14.33 24.18,7.21 24.28,7.11 24.89,6.5 25.81,6.5 27.74,8.43 v30.99,8.43
B5/MOSI3  (via drill 0.4)
  Top 0.203: U1.3 36.22,5.33 35.66,4.78 33.22,4.78 31.9,4.78 31.8,4.78 31.39,4.37 27.64,4.37 26.52,3.25 v25.91,3.25 | 26.89,6.71 U4.5 | v22.96,4.17 23.57,4.17 24.59,5.18 26.62,5.18 26.82,5.38 U4.5 | v25.4,7.42 26.62,7.42 26.82,7.21 U4.5
  Bottom 0.203: v25.91,3.25 23.88,3.25 v22.96,4.17 | JP3.4 23.98,21.44 23.98,19.81 24.59,19.2 24.59,8.23 v25.4,7.42
B6/SCL  (via drill 0.4)
  Top 0.203: U1.5 37.62,7.45 37.8,7.62 43.18,7.62 v43.59,8.03
  Bottom 0.203: v43.59,8.03 42.88,8.74 42.88,9.55 43.18,9.86 43.18,20.32 JP3.11
B7/SDA  (via drill 0.4)
  Top 0.203: v43.59,9.14 43.59,9.04 43.28,8.74 42.57,8.03 37.59,8.03 36.92,7.35 U1.4
  Bottom 0.203: JP3.12 44.45,19.76 43.59,18.9 v43.59,9.14
C2/ADC12
  Top 0.203: U1.2 35.52,5.95 35.52,5.45 35.26,5.18 34.75,5.18 33.22,5.18 31.7,5.18 31.6,5.18 31.19,4.78 27.43,4.78 27.03,4.37 26.62,3.96 26.31,3.96 25.2,3.96 23.67,2.44 21.84,2.44 21.64,2.23 21.64,1.32 JP1.10
C3/ADC13
  Top 0.203: U1.1 34.82,5.86 34.65,5.69 34.54,5.59 33.22,5.59 31.5,5.59 31.39,5.59 31.09,5.28 30.99,5.18 28.14,5.18 27.23,5.18 26.42,4.37 24.99,4.37 23.47,2.85 21.64,2.85 21.23,2.44 19.3,2.44 19.1,2.23 19.1,1.32 JP1.11
C5  (via drill 0.4)
  Top 0.203: v38.2,8.84 37.8,8.84 36.58,7.62 36.57,7.61 U1.54
  Bottom 0.203: v38.2,8.84 38.91,9.55 38.91,14.53 39.62,15.24 39.62,16.15 39.62,21.34 JP3.10
C7  (via drill 0.4)
  Top 0.203: U1.53 35.54,8.31 v35.76,8.53
  Bottom 0.203: JP3.9 36.88,21.54 37.39,21.03 37.9,20.52 38.61,19.81 38.86,19.56 39.12,19.3 39.12,17.14 38.86,16.89 37.97,16 37.97,15.37 36.96,14.35 35.81,14.35 35.31,13.84 35.26,13.79 35.26,13.11 35.87,12.5 35.87,12.29 36.17,11.99 36.17,8.94 v35.76,8.53
D+  (via drill 0.4)
  Top 0.203: X3.D+ 6.45,11.43 6.6,11.28 6.6,10.77 7.62,9.75 v9.04,9.75 | v22.86,9.75 23.37,9.75 24.79,9.75 v25.4,9.14 | U1.51 32.86,9.71 32.61,9.96 32.61,10.36 32.21,10.77 31.5,10.77 31.09,10.36 31.09,9.35 31.19,9.25 31.7,9.25 v32,8.94
  Bottom 0.203: v9.04,9.75 v22.86,9.75 | v25.4,9.14 25.5,9.25 27.43,9.25 27.84,8.84 30.07,8.84 30.58,9.35 31.6,9.35 v32,8.94
D-  (via drill 0.4)
  Top 0.203: X3.D- 6.72,12.08 7.01,11.79 7.01,11.07 7.32,10.77 v9.04,10.77 | v22.86,10.77 23.37,10.77 24.79,10.77 v25.4,10.16 | U1.52 32.95,9.01 32.41,9.55 32.31,9.65 32.21,9.65 v31.8,10.06
  Bottom 0.203: v9.04,10.77 v22.86,10.77 | v25.4,10.16 25.91,9.65 27.64,9.65 28.04,9.25 29.87,9.25 30.38,9.75 31.5,9.75 v31.8,10.06
DFU/SCK3  (via drill 0.4)
  Top 0.203: U1.41 34.82,17.91 34.54,18.19 34.54,19 34.85,19.3 35.97,19.3 36.58,19.3 v37.19,18.69 37.8,19.3 38.2,19.3 43.48,19.3 43.59,19.2 v44.3,18.49 | U4.6 28.09,9.3 27.53,9.86 27.43,9.96 27.43,13.41 27.43,14.02 27.33,14.12 v26.92,14.12
  Bottom 0.203: v44.3,18.49 43.99,18.19 43.99,9.86 44.3,9.55 44.3,1.42 JP1.1 | v26.92,14.12 31.9,14.12 32.21,14.43 32.21,15.04 32.72,15.54 32.72,15.95 33.63,16.87 34.44,16.87 36.47,16.87 37.19,17.58 v37.19,18.69
EN  (via drill 0.4)
  Top 0.203: U2.3 17.72,18.59 | 17.72,18.59 17.72,20.26 JP3.2 | R4.1 v22.86,19.91 | v17.68,18.59 17.72,18.59
  Bottom 0.203: v22.86,19.91 21.95,19 21.54,18.59 v17.68,18.59
GND  (via drill 0.4)
  Top 0.203: U1.64 41.02,11.81 40.84,11.99 40.13,11.99 39.93,11.79 39.4,11.79 U1.63
  Top 0.254: U1.16 45.65,8.31 45.97,8.64 46.23,8.64 46.48,8.89 46.53,8.94 v46.53,9.35
  Top 0.305: U1.18 44.34,9.71 44.14,9.71 43.99,9.86
  other vias: 38.81,15.75 38.1,14.33 38.2,11.18 40.54,9.55 40.54,14.33 45.44,5.13 43.59,5.28 46.43,11.89 45.42,18.49 49.58,18.49 42.47,18.39 40.54,5.28 28.65,17.78 34.95,9.86 32.31,6.4 25.81,11.48 32.31,17.07 27.13,17.68 32.41,18.64 15.24,3.15 20.62,3.66 4.57,0.81 23.27,7.82 26.82,8.53 20.73,13.61 40.23,3.56 32.41,7.92 35.08,12.01 49.83,4.06 46.53,0.97
  pour Top: -0.38,23.24 -0.38,-0.25 50.93,0 50.93,22.86
  pour Bottom: 51.05,0 -0.64,0.38 -0.64,23.24 50.93,22.86
N$1
  Top 0.203: CHG.C 3.46,4.87 4.06,4.27 5.3,4.27 R2.1
N$2
  Top 0.203: L.A 5.57,17.36 5.69,17.48 5.69,19.95 R7.2
N$3
  Top 0.203: R2.2 15.98,4.19 16.56,4.78 16.56,9.14 15.54,10.16 15.54,11.2 U3.1
N$4
  Top 0.203: U3.5 15.55,7.16 R8.1
N$5  (via drill 0.4)
  Top 0.203: v20.02,4.67 20.02,6.6 20.02,7.72 20.62,8.33 v20.62,11.58 | 15.85,13.45 R6.1 15.88,13.5 R3.2 15.86,15.14 13.61,15.14 v13.11,15.65
  Bottom 0.203: SJ1.2 27.81,6.68 26.42,5.28 20.32,5.28 20.02,4.98 v20.02,4.67 | v20.62,11.58 16.66,11.58 15.85,12.39 14.02,14.22 14.02,14.73 v13.11,15.65
N$6  (via drill 0.4, 0.4 pad 0.3)
  Top 0.203: 30.89,11.18 30.68,11.38 30.68,11.82 U4.1 30.87,11.63 v31.6,11.63 | v30.35,19.05 30.35,18.1 R1.1
  Bottom 0.203: v30.35,19.05 30.35,19.3 30.73,19.68 31.37,20.32 32.13,20.32 32.51,20.7 33.27,20.7 33.66,20.32 37.34,20.32 37.47,20.19 38.48,19.18 38.48,17.65 38.35,17.53 35.69,14.86 35.18,14.35 33.4,14.35 31.95,12.9 31.62,12.57 31.62,11.66 v31.6,11.63 30.73,10.77 SJ2.1
SWCLK  (via drill 0.4)
  Top 0.203: U1.40 35.52,18.43 v35.46,18.49 | v28.65,19 26.72,19 JP2.1
  Bottom 0.203: v35.46,18.49 34.75,18.49 34.54,18.49 33.93,17.88 29.77,17.88 v28.65,19
SWDIO  (via drill 0.4)
  Top 0.203: U1.44 31.72,14.61 v31.5,14.83
  Bottom 0.203: JP3.5 26.67,20.68 25.5,19.51 25.4,19.41 25.4,18.49 25.91,17.98 26.21,17.68 26.42,17.48 26.42,15.65 26.72,15.34 27.94,15.34 28.45,14.83 v31.5,14.83
VBAT
  Top 0.406: JP3.1 16.51,20.37 15.95,19.81 15.95,18.69 D1.A 15.93,16.91 R3.1 12.18,16.85 11.79,16.46 11.79,15.61 X1.2 11.79,12.24 C3.1 11.52,11.79 13.41,11.79 13.65,11.54 U3.3
VBUS  (via drill 0.4)
  Top 0.305: 3.35,13.21 3.56,13.21 4.06,12.7 5.19,12.7 X3.VBUS
  Top 0.406: R4.2 19.65,16.83 U2.1 19.62,18.66 D1.C 19.63,19.63 JP3.3 | CHG.A 1.32,5.59 0.51,6.4 0.51,8.94 1.02,9.45 1.02,13.01 1.22,13.21 3.35,13.21 | X3.VBUS 6.6,12.73 | 6.6,12.73 7.37,12.73 C6.1 8.11,11.99 9.86,11.99 10.16,11.68 10.16,9.14 10.46,8.84 13.41,8.84 13.64,8.61 U3.4 | v6.5,13.72 6.5,12.83 6.6,12.73
  Bottom 0.406: JP3.3 21.59,20.47 21.23,20.12 7.32,20.12 6.5,19.3 v6.5,13.72
VRTC  (via drill 0.4)
  Top 0.203: U1.28 43.92,16.29 43.59,15.95 41.35,15.95 v41.15,15.75 | v30.07,2.85 28.35,2.85 v28.14,2.64
  Bottom 0.203: v41.15,15.75 41.15,15.04 41.66,14.53 41.66,13.01 41.05,12.39 40.13,12.39 39.32,11.58 39.32,6.3 39.32,4.57 39.32,4.37 39.32,3.05 39.12,2.85 34.14,2.85 33.02,3.96 32.31,3.96 31.19,2.85 30.38,2.85 v30.07,2.85 | v28.14,2.64 27.94,2.44 12.6,2.44 JP1.14

### Text on the board
tPlace: BAT | EN | B5 | A4 | B4 | C7 | C5 | SCL | SDA | VUSB | A15 | ~ | ~ | ~ | ~ | * | ~ | * | ~ | A15 | SWCLK / SWDIO | Reset | ~ | * | CHG | WICED WiFi / Feather / STM32F205 | ~ | ~ | ~ | ~ | RST | 3V | RTC | C2* | A3* | ~ | ~ | RX | ~ | ~ | GND | WAKE | C3* | A2* | A1* | SCK | MOSI | MISO | TX | DFU
bPlace: 3.7/4.2V / LiPoly Batt / μUSB charge | WICED Feather / Developer Edition | SPIFCS / (A4) | STM32F205RG @ 120MHz / 1MB FLASH + 128K SRAM / Opt. 2MB SPI Flash | BATADC / (A1)